# Altium schematic sheet MCU.SchDoc
size A; SheetNumber: 2; SheetTotal: 15
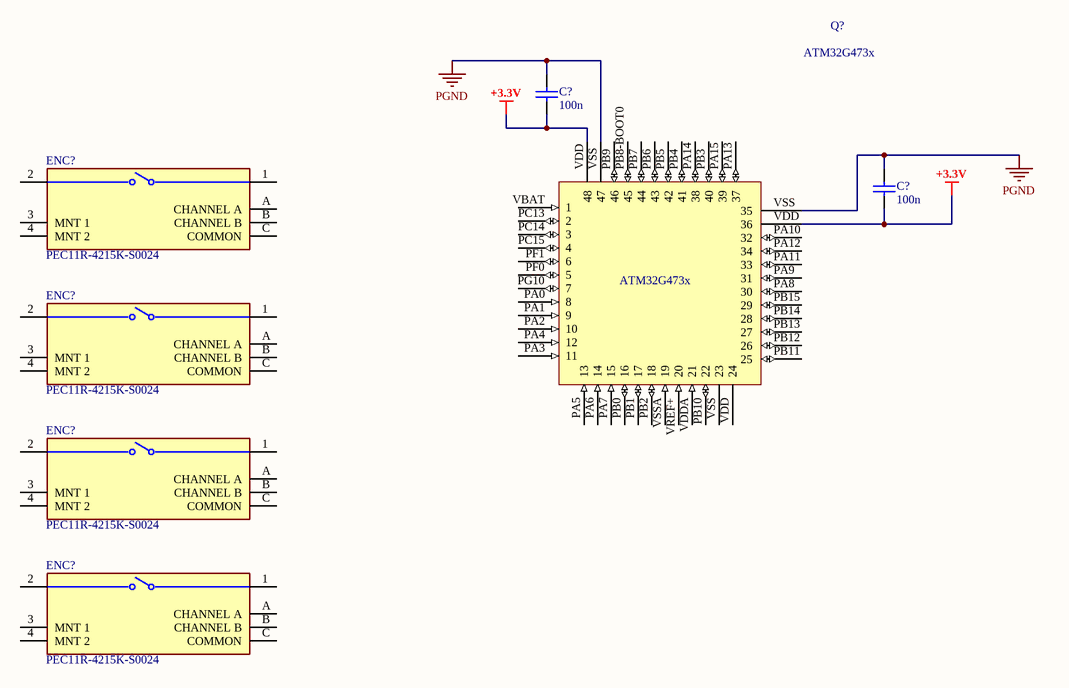
[diagram p0: MCU.SchDoc]

## Parts
(Parts that share a designator on the sheet are numbered #1, #2 ... from top to bottom, then left to right.)
C?#1  value 100n  (hidden comment: Capacitor)
C?#2  value 100n  (hidden comment: Capacitor)
ENC?#1  PEC11R-4215K-S0024  [FP-PEC11R-4215K-S0024-MFG]
ENC?#2  PEC11R-4215K-S0024  [FP-PEC11R-4215K-S0024-MFG]
ENC?#3  PEC11R-4215K-S0024  [FP-PEC11R-4215K-S0024-MFG]
ENC?#4  PEC11R-4215K-S0024  [FP-PEC11R-4215K-S0024-MFG]
Q?  ATM32G473x  [CQFP50P900X900X160-48N]

## Nets
+3.3V: C?#1.1 C?#2.1 Q?.VDD(24)
PGND: C?#1.2 C?#2.2 Q?.VSS(23)

Not connected (* = marked no-connect by the designer): ENC?#1 1 2 3(MNT_1) 4(MNT_2) A(CHANNEL_A) B(CHANNEL_B) C(COMMON); ENC?#2 1 2 3(MNT_1) 4(MNT_2) A(CHANNEL_A) B(CHANNEL_B) C(COMMON); ENC?#3 1 2 3(MNT_1) 4(MNT_2) A(CHANNEL_A) B(CHANNEL_B) C(COMMON); ENC?#4 1 2 3(MNT_1) 4(MNT_2) A(CHANNEL_A) B(CHANNEL_B) C(COMMON); Q? PA0(8) PA1(9) PA2(10) PA3(11) PA4(12) PA5(13) PA6(14) PA7(15) PA8(30) PA9(31) PA10(32) PA11(33) PA12(34) PA13(37) PA14(38) PA15(39) PB0(16) PB1(17) PB2(18) PB3(40) PB4(41) PB5(42) PB6(43) PB7(44) PB8-BOOT0(45) PB9(46) PB10(22) PB11(25) PB12(26) PB13(27) PB14(28) PB15(29) PC13(2) PC14(3) PC15(4) PF0(5) PF1(6) PG10(7) VBAT(1) VDDA(21) VREF+(20) VSSA(19)

## Library data of the parts
C?#1 C?#2 = Capacitor: SimulationGenericComponent: True
ENC?#1-ENC?#4 = CMP-07421-000020-1: ROTARY ENCODER MECHANICAL 24PPR; Built in Switch: Yes; Output Type: Quadrature; Pulses per Revolution: 24; Number of Channels: 2; Max Supply Voltage (DC): 5V; Hole Diameter: 1.8mm; Packaging: Bulk; Series: PEC11R; REACH SVHC: No SVHC; Mount: Through Hole; RoHS Compliant: Yes; Length: 21.5mm; Termination: PC Pin; Width: 12.5mm; Min Operating Temperature: -30°C; Package Quantity: 150; Orientation: Vertical; Encoder Type: Mechanical; Height: 13.4mm; Detent: Yes; Max Operating Temperature: 70°C
Q? = ATM32G473x: Arm® Cortex®-M4 32-bit MCU+FPU, up to 512 KB Flash, 170 MHz / / 213DMIPS, 128 KB SRAM